# EAGLE design TVHR-PIDer (EAGLE 7.2.0)
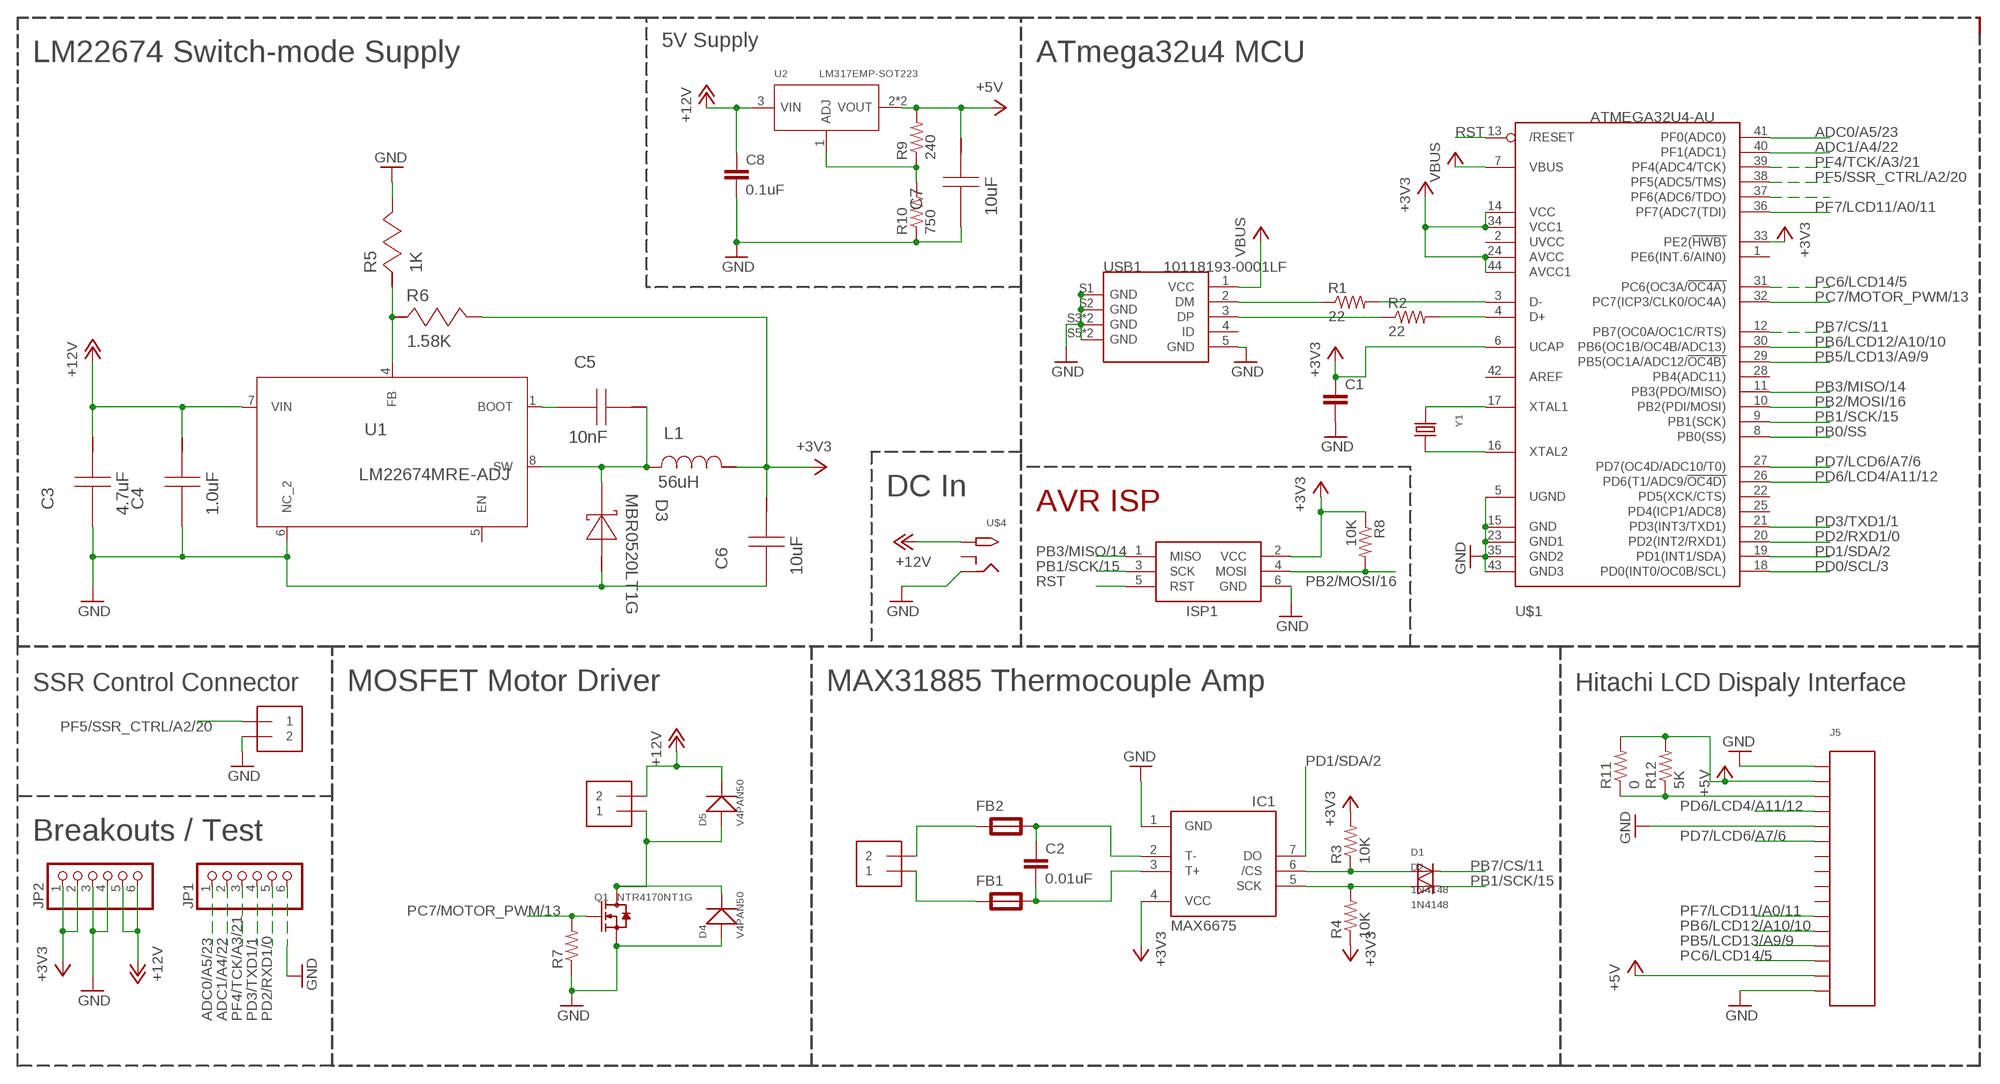
[diagram p0: schematic, sheet 1]

## Parts
C1  C-EUC0603  [C0603]
C2  0.01uF  C-EUC0603  [C0603]
C3  4.7uF  GRM21BR61E475KA12L  [0805]
C4  1.0uF  GRM188R71C105KA12D  [0603]
C5  10nF  C0805C103K5RACTU  [0805]
C6  10uF  GRM219R60J106KE19D  [0805]
C7  10uF  GRM219R60J106KE19D  [0805]
C8  0.1uF  C-EUC0603  [C0603]
D1  1N4148  DIODESOD-323F  [SOD-323F]
D2  1N4148  DIODESOD-323F  [SOD-323F]
D3  MBR0520LT1G  [SOD-123]
D4  V4PAN50  SMD-DIODE-50V-4A(DO-221BC)  [SMD-DIODE-DO221BC-2]
D5  V4PAN50  SMD-DIODE-50V-4A(DO-221BC)  [SMD-DIODE-DO221BC-2]
FB1  FERRITE-BEAD  [R0805]
FB2  FERRITE-BEAD  [R0805]
IC1  MAX6675  [SO08]
ISP1  AVRISP-BOX  [AVRISP-BOX]
J2  1X2-3.5MM  [1X2-3.5MM]
J3  1X2-3.5MM  [1X2-3.5MM]
J4  1X2-3.5MM  [1X2-3.5MM]
J5  16X2-CHAR-LCD-MODULE  [H16-2.54]
JP1  PINHD-1X6  [1X06]
JP2  PINHD-1X6  [1X06]
L1  56uH  ELL-6UH560M  [ELL6UH]
Q1  NTR4170NT1G  SMD-MOSFET-N-CHAN-30V-3.1A-NTR4170N(SOT23)  [SOT-23]
R1  22  R-US_R0603  [R0603]
R2  22  R-US_R0603  [R0603]
R3  10K  R-US_R0603  [R0603]
R4  10K  R-US_R0603  [R0603]
R5  1K  ERJ-6ENF1001V  [0805]
R6  1.58K  ERJ-6ENF1581V  [0805]
R7  R-US_R0603  [R0603]
R8  10K  R-US_R0603  [R0603]
R9  240  R-US_R0603  [R0603]
R10  750  R-US_R0603  [R0603]
R11  0  R-US_R0603  [R0603]
R12  5K  R-US_R0603  [R0603]
U1  LM22674MRE-ADJ  LM22674MRE-ADJ/NOPB  [MRA08B]
U2  LM317EMP-SOT223  PMIC-LDO-LM317EMP(SOT223)  [SOT-223]
U$1  ATMEGA32U4-AU  [TQFP44]
U$4  2.1MMJACKTHM  [PJ-102A]
USB1  10118193-0001LF  MICRO-USB-SMD-B-(10118193-0001LF)  [MICRO-USB5+6P-SMD-0.65-B]
Y1  SMD-XTAL--ABM3B-8.000MHZ-B2-T  [XTAL-SMD-5.0X3.2X1.1MM]

## Nets
+3V3 [PWR]: C1.1 C6.1 IC1.4(VCC) ISP1.2(VCC) JP2.1 JP2.2 L1.2 R3.2 R4.1 R6.1 R8.1 U$1.6(UCAP) U$1.14(VCC) U$1.24(AVCC) U$1.33(PE2(!HWB)) U$1.34(VCC1) U$1.44(AVCC1)
+5V: C7.1 J5.2 J5.15 R9.2 R11.2 R12.2 U2.2(VOUT) U2.TER(VOUT)
+12V: C3.1 C4.1 C8.1 D5.P$2(-) J4.2 JP2.5 JP2.6 U1.7(VIN) U2.3(VIN) U$4.TIP
ADC0/A5/23: JP1.1 U$1.41(PF0(ADC0))
ADC1/A4/22: JP1.2 U$1.40(PF1(ADC1))
GND [PWR]: C1.2 C3.2 C4.2 C6.2 C7.2 C8.2 D3.2(A) D4.P$1(+) IC1.1(GND) ISP1.6(GND) J3.2 J5.1 J5.5 J5.16 JP1.6 JP2.3 JP2.4 Q1.2(S) R5.1 R7.1 R10.1 U1.6(NC_2) U$1.5(UGND) U$1.15(GND) U$1.23(GND1) U$1.35(GND2) U$1.43(GND3) U$4.RING USB1.5(GND) USB1.S1(GND) USB1.S2(GND) USB1.S3(GND) USB1.S4(GND) USB1.S5(GND) USB1.S6(GND)
N$1: R1.2 U$1.3(D-)
N$2: R1.1 USB1.2(DM)
N$3: R2.1 USB1.3(DP)
N$4: U$1.17(XTAL1) Y1.P$1
N$5: R2.2 U$1.4(D+)
N$6: U$1.16(XTAL2) Y1.P$2
N$7: C2.1 FB2.2 IC1.2(T-)
N$8: C2.2 FB1.2 IC1.3(T+)
N$9: R9.1 R10.2 U2.1(ADJ)
N$10: FB2.1 J2.2
N$11: FB1.1 J2.1
N$12: R5.2 R6.2 U1.4(FB)
N$13: J5.3 R11.1 R12.1
N$17: C5.2 U1.1(BOOT)
N$18: C5.1 D3.1(K) L1.1 U1.8(SW)
N$19: D4.P$2(-) D5.P$1(+) J4.1 Q1.3(D)
N$22: U$1.37(PF6(ADC6/TDO))
PB0/SS: U$1.8(PB0(SS))
PB1/SCK/15: D2.A D2.C IC1.5(SCK) ISP1.3(SCK) R4.2 U$1.9(PB1(SCK))
PB2/MOSI/16: ISP1.4(MOSI) R8.2 U$1.10(PB2(PDI/MOSI))
PB3/MISO/14: ISP1.1(MISO) U$1.11(PB3(PDO/MISO))
PB5/LCD13/A9/9: J5.13 U$1.29(PB5(OC1A/ADC12/!OC4B))
PB6/LCD12/A10/10: J5.12 U$1.30(PB6(OC1B/OC4B/ADC13))
PB7/CS/11: D1.A D1.C IC1.6(/CS) R3.1 U$1.12(PB7(OC0A/OC1C/RTS))
PC6/LCD14/5: J5.14 U$1.31(PC6(OC3A/!OC4A))
PC7/MOTOR_PWM/13: Q1.1(G) R7.2 U$1.32(PC7(ICP3/CLK0/OC4A))
PD0/SCL/3: U$1.18(PD0(INT0/OC0B/SCL))
PD1/SDA/2: IC1.7(DO) U$1.19(PD1(INT1/SDA))
PD2/RXD1/0: JP1.5 U$1.20(PD2(INT2/RXD1))
PD3/TXD1/1: JP1.4 U$1.21(PD3(INT3/TXD1))
PD6/LCD4/A11/12: J5.4 U$1.26(PD6(T1/ADC9/!OC4D))
PD7/LCD6/A7/6: J5.6 U$1.27(PD7(OC4D/ADC10/T0))
PF4/TCK/A3/21: JP1.3 U$1.39(PF4(ADC4/TCK))
PF5/SSR_CTRL/A2/20: J3.1 U$1.38(PF5(ADC5/TMS))
PF7/LCD11/A0/11: J5.11 U$1.36(PF7(ADC7(TDI))
RST: ISP1.5(RST) U$1.13(/RESET)
VBUS [PWR]: U$1.7(VBUS) USB1.1(VCC)
Unconnected: J5.7 J5.8 J5.9 J5.10 U1.5(EN) U$1.1(PE6(INT.6/AIN0)) U$1.2(UVCC) U$1.22(PD5(XCK/CTS)) U$1.25(PD4(ICP1/ADC8)) U$1.28(PB4(ADC11)) U$1.42(AREF) U$4.RING_SW USB1.4(ID)

## Notes on the sheet
- 5V Supply
- LM22674 Switch-mode Supply | ATmega32u4 MCU
- DC In
- AVR ISP
- SSR Control Connector | MOSFET Motor Driver | MAX31885 Thermocouple Amp | Hitachi LCD Dispaly Interface
- Breakouts / Test

## Library data of the parts
C1 C2 C8 = resistor:C-EU: CAPACITOR, European symbol
C3 = TI_LM22674:GRM21BR61E475KA12L; CAP: 4.7E-6; ESR: 0.0040; IRMS: 0.0; MANUFACTURER_NAME: MuRata; MANUFACTURER_PART_NUMBER: GRM21BR61E475KA12L; VDC: 25.0; VENDOR: MuRata
C4 = TI_LM22674:GRM188R71C105KA12D; CAP: 1.0E-6; ESR: 0.011; IRMS: 0.0; MANUFACTURER_NAME: MuRata; MANUFACTURER_PART_NUMBER: GRM188R71C105KA12D; VDC: 16.0; VENDOR: MuRata
C5 = TI_LM22674:C0805C103K5RACTU; CAP: 1.0E-8; ESR: 1.739; IRMS: 0.411; MANUFACTURER_NAME: Kemet; MANUFACTURER_PART_NUMBER: C0805C103K5RACTU; VDC: 50.0; VENDOR: Kemet
C6 C7 = TI_LM22674:GRM219R60J106KE19D; CAP: 1.0E-5; ESR: 0.0030; IRMS: 0.0; MANUFACTURER_NAME: MuRata; MANUFACTURER_PART_NUMBER: GRM219R60J106KE19D; VDC: 6.3; VENDOR: MuRata
D1 D2 = adafruit:DIODE: Diode SMADIODE - SMA Surface Mount Package 20V 1A Schottky Diode Digikey: 641-1014-6-ND DO-1N4148 - Through Hole Small Current Diode SOD-123 20V 1 A (.5mV Vf) Schottky Diode - Digikey: MBRX120TPMSCT-ND SOD-323 10V 570mA (.38mV Vf, 3ns) Schottky Diode - Digikey: ZLLS410CT-ND SOD-523 30V 30mA Schottky Diode (RB751S-40TE61) - Digikey: RB751S-40TE61CT-ND SOT23-R/W - SOT23 Package (R = Solder Paste/Reflow Ovens, W = Hand-Soldering) BAT54Film 40V 300mA - Digikey: 497-7162-1-ND
D3 = TI_LM22674:MBR0520LT1G; DATASHEETURL: http://www.onsemi.com/pub%5Flink/Collateral/MBR0520LT1%2DD.PDF; IO: 0.5; MANUFACTURER_NAME: ON Semiconductor; MANUFACTURER_PART_NUMBER: MBR0520LT1G; VENDOR: ON Semiconductor; VFATIO: 0.385; VRRM: 20.0
D4 D5 = TVHeadedRobots-library:SMD-DIODE-50V-4A(DO-221BC); MF: VISHAY; MPN: V4PAN50; OC_MOUSER: 78-V4PAN50-M3/I
FB1 FB2 = TVHeadedRobots-library:FERRITE-BEAD
IC1 = adafruit:MAX6675
ISP1 = adafruit:AVRISP: AVR ISP HEADER Standard 6 pin header for AVR programming
J2-J4 = adafruit:1X2: 3.5mm Terminal block http://www.ladyada.net/library/pcb/eaglelibrary.html
J5 = TVHeadedRobots-library:16X2-CHAR-LCD-MODULE
JP1 JP2 = adafruit:PINHD-1X6: PIN HEADER
L1 = TI_LM22674:ELL-6UH560M; DCR: 0.21; IDC: 0.8; L: 5.6E-5; MANUFACTURER_NAME: Panasonic; MANUFACTURER_PART_NUMBER: ELL-6UH560M; VENDOR: Panasonic
Q1 = TVHeadedRobots-library:SMD-MOSFET-N-CHAN-30V-3.1A-NTR4170N(SOT23): NTR4170NT1G N-Chan Power MOSFET 30V / 3.1A; MPN: NTR4170N; OC_MOUSER: 863-NTR4170NT1G
R1-R4 R7-R12 = resistor:R-US_: RESISTOR, American symbol
R5 = TI_LM22674:ERJ-6ENF1001V; MANUFACTURER_NAME: Panasonic; MANUFACTURER_PART_NUMBER: ERJ-6ENF1001V; POWER: 0.125; RESISTANCE: 1000.0; TOLERANCE: 1.0; VENDOR: Panasonic
R6 = TI_LM22674:ERJ-6ENF1581V; MANUFACTURER_NAME: Panasonic; MANUFACTURER_PART_NUMBER: ERJ-6ENF1581V; POWER: 0.125; RESISTANCE: 1580.0; TOLERANCE: 1.0; VENDOR: Panasonic
U1 = TI_LM22674:LM22674MRE-ADJ/NOPB; DATASHEETURL: http://www.ti.com/product/lm22674; FREQUENCY: 500000.0; IMAX: 0.5; MANUFACTURER_NAME: Texas Instruments; MANUFACTURER_PART_NUMBER: LM22674MRE-ADJ/NOPB; MKTG_PACKAGE: NA; NSID: LM22674MRE-5.0/NOPB; PACKAGE: NA; VENDOR: Texas Instruments
U2 = Seeed-OPL-ic:PMIC-LDO-LM317EMP(SOT223): 310030006; MPN: LM317EMP
U$1 = adafruit:ATMEGA32U4: http://www.ladyada.net/library/eagle
U$4 = adafruit:2.1MMJACK: 2.1mm x 5.5mm THM DC jack with internal switch. Digikey part #PJ-102A, 4UCON part #05537 2.1mm x 5.5mm SMT DC jack with internal switch. Digikey part #PJ-002A-SMT, 4UCON part #03267 By microbuilder.eu & adafruit.com
USB1 = Seeed-OPL-Connector:MICRO-USB-SMD-B-(10118193-0001LF): 320010003; MPN: 10118193-0001LF
Y1 = TVHeadedRobots-library:SMD-XTAL--ABM3B-8.000MHZ-B2-T; MF: Abracon; MPN: ABM3B-8.000MHZ-B2-T; OC_MOUSER: 815-ABM3B-8.0-B2-T

## Net classes
0 default: width 0.203 mm, clearance 0.203 mm
1 PWR: width 0.406 mm, clearance 0.406 mm
2 ADC: width 0.203 mm, clearance 0.406 mm
3 PWM: width 0.203 mm, clearance 0.305 mm

## Board
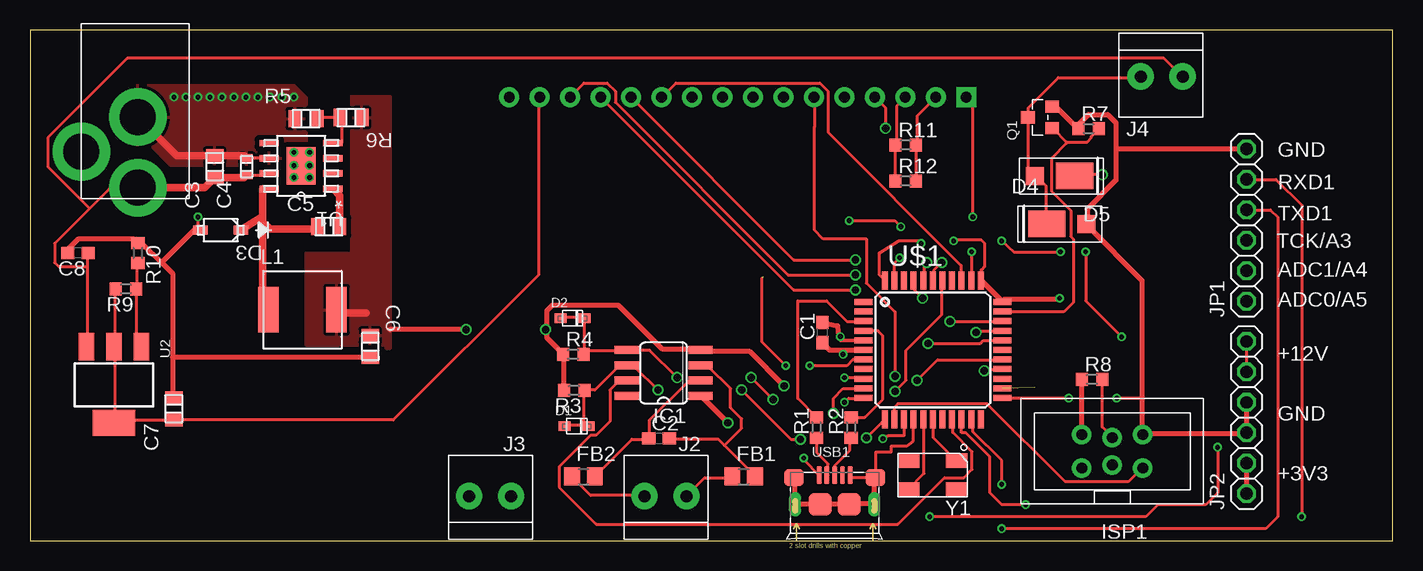
[diagram p1: board, top side]
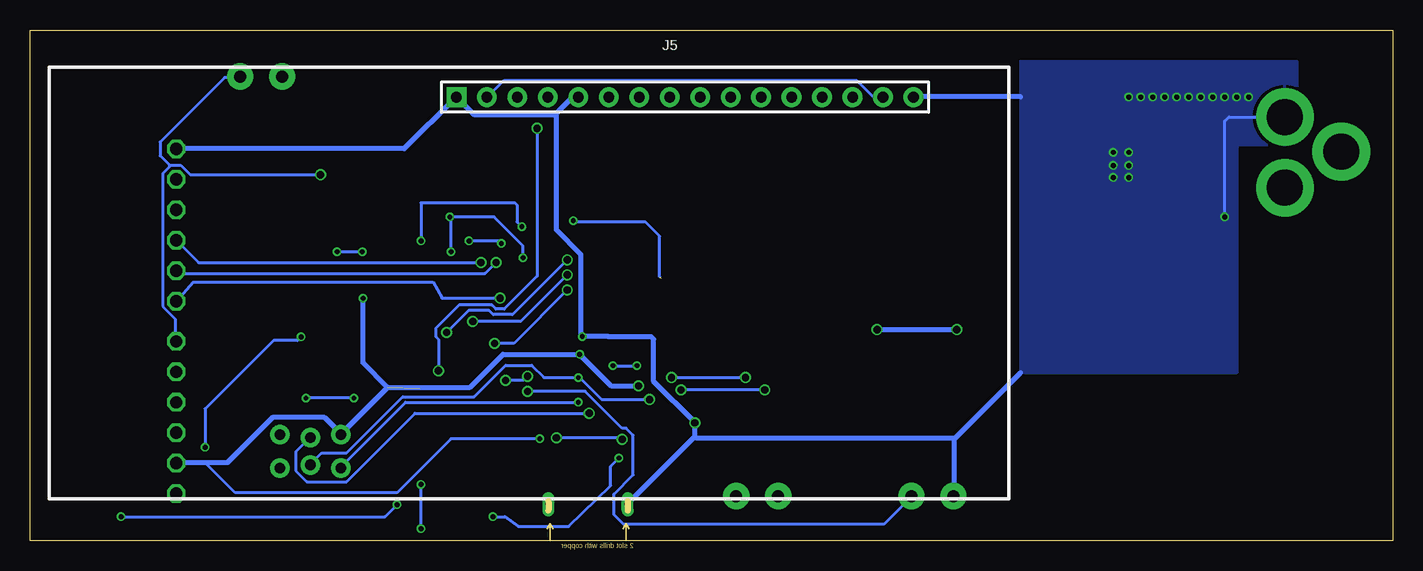
[diagram p2: board, bottom side, seen from below]

Size 113.6 x 42.6 mm. Coordinates in mm from the lower left corner, seen from the top.
Outline: 0,0 113.6,0 113.6,42.6 0,42.6 0,0
Copper layers (1*16): Top 0.035mm / dielectric 1.5mm / Bottom 0.035mm
Design rules "SeeedStudio_2layer_DRU_no_angle_20140221": minimum track width 6mil, minimum drill 12mil, track to track 6mil, track to pad 6mil, pad to pad 6mil, via to via 6mil, smd to smd 0mil, copper to edge 10mil, drill to drill 10mil, minimum pad ring 10mil, minimum via ring 6mil, stop-mask expansion 2mil, vias tented up to drill 100mil, thermal gap 10mil

### Footprints (pad centres in the part's own frame; a part is rotated, then mirrored left to right if it is on the bottom)
C0603 = smd 1.1 x 1: 1 -0.85,0; 2 0.85,0
0805 = smd 1.118 x 1.448: 1 -0.902,0; 2 0.902,0
0603 = smd 0.66 x 0.965: 1 -0.699,0; 2 0.699,0
SOD-323F = smd 1 x 0.8: A -1,0; C 1,0
SOD-123 = smd 1.219 x 0.762: 1 -1.676,0; 2 1.676,0
SMD-DIODE-DO221BC-2 = smd 1.5 x 1.52: P$1 1.19,0 | smd 3.1 x 2.2: P$2 -2.11,0
R0805 = smd 1.3 x 1.5: 1 -0.95,0; 2 0.95,0
SO08 = smd 0.66 x 2.032: 1 -1.905,-3.073; 2 -0.635,-3.073; 3 0.635,-3.073; 4 1.905,-3.073; 5 1.905,3.073; 6 0.635,3.073; 7 -0.635,3.073; 8 -1.905,3.073
AVRISP-BOX = drill 0.9 pad 1.626: 1 -1.397,2.54; 2 1.397,2.54; 3 -1.143,0; 4 1.143,0; 5 -1.397,-2.54; 6 1.397,-2.54
1X2-3.5MM = drill 1 pad 2.184: 1 1.8,0; 2 -1.7,0
H16-2.54 = drill 0.889 pad 1.651 square: 1 -19.05,0 | drill 0.889 pad 1.651: 2 -16.51,0; 3 -13.97,0; 4 -11.43,0; 5 -8.89,0; 6 -6.35,0; 7 -3.81,0; 8 -1.27,0; 9 1.27,0; 10 3.81,0; 11 6.35,0; 12 8.89,0; 13 11.43,0; 14 13.97,0; 15 16.51,0; 16 19.05,0
1X06 = drill 1.016 octagon: 1 -6.35,0; 2 -3.81,0; 3 -1.27,0; 4 1.27,0; 5 3.81,0; 6 6.35,0
ELL6UH = smd 1.702 x 3.81: 1 -2.845,0; 2 2.845,0
SOT-23 = smd 1.016 x 1.143: 1 -0.889,-1.016; 2 0.889,-1.016; 3 0,1.016
R0603 = smd 1 x 1.1: 1 -0.85,0; 2 0.85,0
MRA08B = smd 1.6 x 0.533: 1 -2.654,1.905; 2 -2.654,0.635; 3 -2.654,-0.635; 4 -2.654,-1.905; 5 2.654,-1.905; 6 2.654,-0.635; 7 2.654,0.635; 8 2.654,1.905 | smd 2.413 x 3.099: 9 0,0
SOT-223 = smd 1.27 x 2.286: 1 -2.286,-3.175; 2 0,-3.175; 3 2.286,-3.175 | smd 3.556 x 2.159: TER 0,3.175
TQFP44 = smd 1.5 x 0.5: 1 -5.8,4; 2 -5.8,3.2; 3 -5.8,2.4; 4 -5.8,1.6; 5 -5.8,0.8; 6 -5.8,0; 7 -5.8,-0.8; 8 -5.8,-1.6; 9 -5.8,-2.4; 10 -5.8,-3.2; 11 -5.8,-4; 23 5.8,-4; 24 5.8,-3.2; 25 5.8,-2.4; 26 5.8,-1.6; 27 5.8,-0.8; 28 5.8,0; 29 5.8,0.8; 30 5.8,1.6; 31 5.8,2.4; 32 5.8,3.2; 33 5.8,4 | smd 0.5 x 1.5: 12 -4,-5.8; 13 -3.2,-5.8; 14 -2.4,-5.8; 15 -1.6,-5.8; 16 -0.8,-5.8; 17 0,-5.8; 18 0.8,-5.8; 19 1.6,-5.8; 20 2.4,-5.8; 21 3.2,-5.8; 22 4,-5.8; 34 4,5.8; 35 3.2,5.8; 36 2.4,5.8; 37 1.6,5.8; 38 0.8,5.8; 39 0,5.8; 40 -0.8,5.8; 41 -1.6,5.8; 42 -2.4,5.8; 43 -3.2,5.8; 44 -4,5.8
PJ-102A = drill 3 pad 4.8: RING 0.1,-3.39; RING_SW -4.6,-6.29; TIP 0.1,-9.29
MICRO-USB5+6P-SMD-0.65-B = smd 0.4 x 1.5: 1 -1.3,-0.25; 2 -0.65,-0.25; 3 0,-0.25; 4 0.65,-0.25; 5 1.3,-0.25 | smd 1.6 x 1.4: S1 -3.4,-0.427; S6 3.4,-0.427 | drill 0.508 pad 1.016 long: S2 -3.3,-2.675; S5 3.3,-2.675 | smd 1.9 x 1.9: S3 -1.2,-2.675; S4 1.2,-2.675
XTAL-SMD-5.0X3.2X1.1MM = smd 1.8 x 1.2: P$1 -2,-1.2; P$2 2,1.2; P$3 2,-1.2; P$4 -2,1.2

### Placement (x,y rotation side)
C1  66.06,17.36 90 top
C2  52.44,8.55 0 top
C3  15.41,31.2 90 top
C4  18.06,31.2 90 top
C5  24.91,26.2 0 top
C6  28.36,16.2 270 top
C7  12,11 90 top
C8  4,24 180 top
D1  45.58,9.55 0 top
D2  45.23,18.55 0 top
D3  15.9,25.91 180 top
D4  86.87,26.42 0 top
D5  84.98,30.42 180 top
FB1  59.49,5.36 0 top
FB2  46.14,5.36 0 top
IC1  52.82,13.99 90 top
ISP1  90.22,7.46 90 top
J2  52.93,3.72 0 top
J3  38.31,3.72 0 top
J4  94.39,38.72 180 top
J5  59,37 0 bottom
JP1  101.41,26.33 90 top
JP2  101.41,10.28 90 top
L1  22.71,19.26 0 top
Q1  84.2,35.31 90 top
R1  65.57,9.45 90 top
R2  68.46,9.45 90 top
R3  45.36,12.55 180 top
R4  45.28,15.55 0 top
R5  23.01,35.2 0 top
R6  26.76,35.3 180 top
R7  88.25,34.36 0 top
R8  88.53,13.46 0 top
R9  8,21 180 top
R10  9,24 270 top
R11  73,33 0 top
R12  73,30 0 top
U1  22.6,31.26 180 top
U2  7,13 180 top
U$1  75.26,15.91 0 top
U$4  8.89,38.74 0 top
USB1  67.08,5.71 0 top
Y1  75.26,5.48 180 top

### Tracks (layer width: path | path; a pad name or v marks a point on that pad's centre or on a via)
+3V3  (via drill 0.4, 0.61)  (1 unrouted)
  Top 0.254: U$1.44 70.8,22.17 70.8,24 72.4,25 74.1,25 v74.3,24.8 | 77.2,25 v77,25 77,25.1 79.3,25.1 79.6,24.8 79.6,22.9 79.3,22.6 79.3,21.75 U$1.34 | U$1.14 72.86,8.76 71.56,8.76 v71.1,8.5
  Top 0.406: C1.1 66.66,15.91 67.78,15.91 | 67.78,15.91 U$1.6 | R3.2 44.46,12.57 44.46,15.54 R4.1 44.35,15.66 43.09,16.92 43.09,17.6 | 43.09,17.6 43.09,19.2 43.55,19.66 49.03,19.66 52.69,16 55.89,16 IC1.4 56.01,15.77 60.01,15.77 v62.87,12.92 | JP2.1 101.38,4 101.38,6.4 JP2.2 | U$1.34 79.32,21.72 81.04,20 U$1.33 81.15,20.12 85.72,20.12 v85.84,20.23 | R8.1 87.67,13.37 87.67,8.91 ISP1.2 | v67.78,15.54 67.78,15.91 | v36.35,17.6 30,17.6 | v42.98,17.6 43.09,17.6
  Top 0.61: L1.2 25.82,19 28,19
  Bottom 0.254: v71.1,8.5 78.5,8.5 83,4 96.48,4 99,6.51 | v74.3,24.8 74.5,25 v77,25
  Bottom 0.406: 83.78,12.8 76.92,12.8 74.18,15.54 v67.78,15.54 65.15,12.92 v62.87,12.92 | 83.78,12.8 87.67,8.91 ISP1.2 87.78,9.03 89.04,10.29 93.38,10.29 97.16,6.51 99,6.51 101.38,6.51 JP2.2 | v85.84,20.23 85.84,14.86 83.78,12.8 | v42.98,17.6 v36.35,17.6
  pour Top: 29.7,16.3 23,16.3 23,24 26.8,24 26.8,37.1 30,37.1 30,16 29.7,16
+5V
  Top 0.254: R9.2 7.09,20.92 7.09,16.23 U2.2 7.09,16.12 7.09,10.4 7.32,10.17 U2.TER 7.09,9.83 7.32,10.06 11.89,10.06 C7.1 12.12,10.06 30.29,10.06 42.41,22.17 42.41,36.92 J5.15 | R12.2 73.84,30.06 73.84,32.92 R11.2 73.95,33.03 73.95,35.43 75.44,36.92 J5.2
  Bottom 0.254: J5.15 42.52,37.03 43.32,37.03 44.69,38.41 74.07,38.41 75.44,37.03 J5.2
+12V  (via drill 0.61)
  Top 0.254: 17.86,30.3 C4.1 19.82,30.5 U1.7 | 4.8,22.86 4.8,16.23 U2.3 | 4.8,22.86 4.8,23.89 C8.1 | 4.8,22.86 2.4,22.86 2.06,23.2 2.06,24.8 4.97,27.72 | 4.97,27.72 6.63,29.38 8.69,29.38 U$4.TIP | JP2.5 101.38,14.17 101.38,16.57 JP2.6 | v89.38,30.52 87.1,30.52 D5.P$2 | 4.97,27.72 1.49,31.2 1.49,33.6 8.12,40.23 94.53,40.23 96.01,38.75 J4.2
  Top 0.61: U$4.TIP 14.56,29.45 C3.1 17.86,30.3
  Bottom 0.254: v89.38,30.52 100.24,30.52 101.04,31.32 101.96,31.32 | 101.96,31.32 102.76,32.12 102.76,33.26 97.38,38.63 96.13,38.63 J4.2 | JP2.6 101.5,16.69 101.5,18.52 102.53,19.55 102.53,30.63 101.96,31.2 101.96,31.32
ADC0/A5/23  (via drill 0.61)
  Top 0.254: v74.41,20.23 73.72,20.92 73.72,21.6 U$1.41
  Bottom 0.254: v74.41,20.23 79.25,20.23 80,21.57 100.01,21.57 101.38,20 JP1.1
ADC1/A4/22  (via drill 0.61)
  Top 0.254: v74.75,23.2 74.52,22.97 74.52,21.72 U$1.40
  Bottom 0.254: v74.75,23.2 75.67,22.29 101.16,22.29 101.38,22.52 JP1.2
GND  (via drill 0.4, 0.61)
  Top 0.254: 17.86,32.1 C4.2 U1.6 | D3.2 14,26.13 v14,27 | USB1.5 68.56,5.28 USB1.S6 70.48,7.38 70.5,7.4 71.8,7.4 71.8,7.9 73.1,7.9 73.6,8.3 73.6,10.05 U$1.15 | U$1.23 v86.6,11.9 | v90.6,11.9 92.7,11.9 | U$1.35 78.5,21.71 v78.5,24.1 | v78.6,27 78.6,36.45 J5.1 | U$1.43 72.06,23.16 v72.5,23.6
  Top 0.305: 67.34,17.93 67.56,16.71 U$1.5
  Top 0.406: C1.2 67.34,17.93 67.44,17.03 v67.55,17.03 | C8.2 3.2,24 3.2,24.35 4,25.15 8.69,25.15 8.91,24.92 R10.1 9.14,24.8 9.37,24.8 10.97,23.2 | 11.89,15.32 11.89,22.29 10.97,23.2 | 11.89,15.32 11.89,12 C7.2 | 11.89,15.32 28.35,15.32 C6.2 | 10.97,23.2 13.95,26.18 D3.2 | JP2.4 101.38,11.54 101.38,9.03 JP2.3 101.27,8.91 92.81,8.91 ISP1.6 92.7,9.03 92.7,11.9 92.7,21.72 88.12,26.29 D4.P$1 88.12,26.52 88.12,27.66 90.53,30.06 90.53,32.69 | Q1.2 85.27,36.12 85.61,36.12 87.33,34.4 R7.1 87.33,34.63 88.24,35.55 89.84,35.55 90.53,34.86 90.53,32.69 | 90.53,32.69 101.38,32.69 JP1.6 | USB1.S6 70.41,5.26 70.41,3.09 USB1.S5 70.18,3.09 68.35,3.09 USB1.S4 68.12,3.09 66.06,3.09 USB1.S3 65.84,3.09 63.89,3.09 USB1.S2 63.78,3.09 63.78,5.26 USB1.S1 | v58.18,9.83 56.01,12 IC1.1
  Top 0.61: 17.86,32.1 C3.2 12.24,32.1 U$4.RING
  Bottom 0.254: v14,27 14,35 13.65,35.35 U$4.RING | v86.6,11.9 v90.6,11.9 | v78.5,24.1 78.5,26.9 v78.6,27 74.9,27 72.5,24.6 v72.5,23.6
  Bottom 0.406: 31,37.03 39.89,37.03 J5.16 | 36.58,8.46 36.58,3.77 J3.2 | 36.58,8.46 31.09,13.95 31,14 | 69.84,35.55 68.47,36.92 67.89,36.92 J5.5 | 69.84,35.55 76.58,35.55 77.95,36.92 J5.1 78.18,36.92 82.41,32.69 101.38,32.69 JP1.6 | 58.18,8.69 v58.18,9.83 58.18,9.88 61.6,13.3 61.6,16.8 61.8,17 65.35,17 65.38,17.03 v67.55,17.03 67.67,17.14 67.67,23.89 69.72,25.95 69.72,35.43 69.84,35.55 | 58.18,8.69 63.78,3.09 USB1.S2 | 36.58,8.46 36.69,8.57 58.06,8.57 58.18,8.69
  other vias: 12,37 13,37 14,37 15,37 16,37 17,37 18,37 19,37 20,37 21,37 22,37 22,32.4 23.3,32.4 22,31.3 23.3,31.3 23.3,30.3 22,30.3
  pour Top: 23,37 23,31.3 11.7,31.3 10,33 7,33 7,38 22,38
  pour Bottom: 31,40 8,40 8,33 13,33 13,14 31,14
N$1
  Top 0.254: R1.2 64,11.87 64,20 66.4,20 68.1,18.3 U$1.3
  Top 0.406: U$1.3
N$2
  Top 0.254: R1.1 65.61,8.57 65.61,7.32 66.52,6.4 66.52,5.49 USB1.2
N$3
  Top 0.254: R2.1 68.35,8.57 68.35,7.54 67.09,6.29 67.09,5.49 USB1.3
N$4
  Top 0.254: U$1.17 75.32,10.06 75.32,8.57 77.15,6.74 Y1.P$1
N$5
  Top 0.254: R2.2 69.6,10.3 71.1,11.8 71.1,17.1 70.7,17.5 70.69,17.51 U$1.4
N$6
  Top 0.254: U$1.16 74.52,10.06 74.52,5.6 73.27,4.34 Y1.P$2
N$7
  Top 0.254: FB2.2 47.09,5.37 50.18,8.46 51.55,8.46 C2.1 51.66,8.57 51.66,10.06 54.86,13.26 55.89,13.26 IC1.2
N$8
  Top 0.254: 57.89,7.94 60.47,5.37 FB1.2 | 57.89,7.94 57.38,8.46 53.38,8.46 C2.2 | 57.89,7.94 59.32,9.37 59.32,10.17 58.41,11.09 58.41,12.69 56.58,14.52 56.01,14.52 IC1.3
N$9
  Top 0.254: R10.2 8.91,23.09 8.91,21.03 R9.1 8.91,20.92 8.91,16.57 9.26,16.23 U2.1
N$10
  Top 0.254: FB2.1 45.26,5.26 46.75,3.77 51.21,3.77 J2.2
N$11
  Top 0.254: FB1.1 58.52,5.26 56.24,5.26 54.75,3.77 J2.1
N$12
  Top 0.254: U1.4 26,33.16 26,35 25.76,35 R6.2 23.91,35.3 R5.2
N$13
  Top 0.254: R12.1 72.12,30.06 72.12,32.92 R11.1 72.24,33.03 72.24,36.23 72.92,36.92 J5.3
N$17
  Top 0.61: U1.1 25.81,28.8 C5.2
N$18
  Top 0.61: C5.1 23.81,26 20,26 19.4,26.6 | 19.4,26.6 19.4,27 | 19.4,27 19.4,29.3 19.45,29.36 U1.8 | L1.1 19.4,19.73 19.4,26.6 | D3.1 19.31,27 19.4,27
N$19
  Top 0.254: D4.P$2 84.7,26.52 84.7,29.6 83.9,30.4 D5.P$1 83.78,30.52 83.21,31.09 83.21,35.2 Q1.3 83.21,35.43 83.21,36.12 85.72,38.63 92.58,38.63 J4.1
PB1/SCK/15  (via drill 0.4, 0.61)
  Top 0.254: D2.A 44.23,18.63 46.18,18.63 D2.C 46.18,18.52 46.18,15.66 R4.2 46.29,15.89 49.72,15.89 IC1.5 49.84,15.89 51.66,15.89 v53.95,13.6 | v67.89,13.6 69.38,13.6 U$1.9 | v61.95,11.77 v60.12,13.6
  Bottom 0.254: ISP1.3 90.18,6.4 89.27,7.32 87.21,7.32 82.53,12 76.58,12 73.95,14.63 71.78,14.63 70.75,13.6 v67.89,13.6 67.78,13.6 65.95,11.77 v61.95,11.77 | v60.12,13.6 v53.95,13.6
PB2/MOSI/16  (via drill 0.61)
  Top 0.254: R8.2 89.38,13.37 89.38,9.49 90.18,8.69 ISP1.4 | v66.98,10.63 66.98,11.89 67.78,12.69 69.38,12.69 U$1.10
  Bottom 0.254: v66.98,10.63 81.5,10.63 87.21,4.92 90.53,4.92 91.44,5.83 91.44,7.43 90.3,8.57 ISP1.4
PB3/MISO/14  (via drill 0.4)
  Top 0.254: v67.89,11.54 68.24,11.89 69.38,11.89 U$1.11
  Bottom 0.254: v67.89,11.54 82.3,11.54 87.67,6.17 ISP1.1
PB5/LCD13/A9/9  (via drill 0.61)
  Top 0.254: v74.87,16.46 79.21,16.46 79.44,16.69 81.04,16.69 U$1.29 | v68.81,20.92 63.66,20.92 47.66,36.92 J5.13
  Bottom 0.254: v74.87,16.46 73.27,16.46 v68.81,20.92
PB6/LCD12/A10/10  (via drill 0.61)
  Top 0.254: v78.87,17.37 78.98,17.49 81.04,17.49 U$1.30 | v68.81,23.43 63.66,23.43 50.18,36.92 J5.12
  Bottom 0.254: v78.87,17.37 77.04,19.2 75.32,19.2 74.98,18.86 73.38,18.86 v68.81,23.43
PB7/CS/11  (via drill 0.61)
  Top 0.254: D1.A 44.69,9.6 46.52,9.6 D1.C 46.18,9.72 46.18,12.46 R3.1 46.29,12.57 47.09,12.57 49.03,14.52 49.72,14.52 IC1.6 49.84,14.52 50.41,14.52 v52.35,12.57 | v69.72,8.57 71.21,10.06 U$1.12 | v64.24,8.46 63.44,8.46 v59.32,12.57
  Bottom 0.254: v69.72,8.57 64.35,8.57 v64.24,8.46 | v52.35,12.57 v59.32,12.57
PC6/LCD14/5  (via drill 0.61)
  Top 0.254: v76.69,18.29 81.04,18.29 U$1.31 | v68.81,22.17 63.21,22.17 48.81,36.58 48.81,37.49 48.12,38.18 46.18,38.18 45.03,37.03 J5.14
  Bottom 0.254: v76.69,18.29 72.69,18.29 v68.81,22.17
PC7/MOTOR_PWM/13
  Top 0.254: 86.41,33.26 88.12,33.26 88.47,33.6 88.47,33.72 89.04,34.29 R7.2 | 86.41,33.26 85.27,34.4 Q1.1 | U$1.32 81.15,19.09 86.18,19.09 86.98,19.89 86.98,25.15 86.75,25.38 86.75,27.55 85.15,29.15 85.15,31.89 86.41,33.15 86.41,33.26
PD1/SDA/2
  Top 0.254: U$1.19 76.92,10.06 76.92,9.03 78.52,7.43 78.52,5.94 77.84,5.26 76.24,5.26 72.35,1.37 47.21,1.37 44.12,4.46 44.12,6.17 46.75,8.8 47.21,8.8 48.35,9.94 48.35,12.57 49.03,13.26 49.72,13.26 IC1.7
PD2/RXD1/0  (via drill 0.4)
  Top 0.254: JP1.5 103.86,30.14 106,28 v106,2 | v83,3 81,3 80,4 80,7 78,9 77.66,9 U$1.20
  Bottom 0.254: v106,2 84,2 v83,3
PD3/TXD1/1  (via drill 0.4)
  Top 0.254: JP1.4 103.4,27.6 104,27 104,2 103,1 v81,1 | v81,4.7 81,6.7 78.6,9.1 78.6,9.97 U$1.21
  Bottom 0.254: v81,1 v81,4.7
PD6/LCD4/A11/12  (via drill 0.61)
  Top 0.254: v79.55,14.17 79.67,14.29 81.04,14.29 U$1.26 | v71.32,34.4 71.32,36.12 70.52,36.92 J5.4
  Bottom 0.254: v79.55,14.17 79.55,16.8 79.78,17.03 79.78,17.72 77.84,19.66 75.09,19.66 74.75,19.32 74.07,19.32 71.32,22.06 v71.32,34.4
PD7/LCD6/A7/6  (via drill 0.61)
  Top 0.254: v73.95,13.37 75.67,15.09 81.04,15.09 U$1.27 | v72.12,13.72 72.12,19.09 69.72,21.49 69.72,25.18 66.12,25.18 65.4,25.9 65.4,34.5 65.38,34.52 65.38,36.92 J5.6
  Bottom 0.254: v73.95,13.37 72.47,13.37 v72.12,13.72
PF4/TCK/A3/21  (via drill 0.61)
  Top 0.254: v76.01,23.2 75.32,22.52 75.32,21.72 U$1.39
  Bottom 0.254: v76.01,23.2 99.56,23.2 101.38,25.03 JP1.3
PF5/SSR_CTRL/A2/20  (via drill 0.61)
  Top 0.254: v72.12,12.46 73.04,13.37 73.04,15.89 76.01,18.86 76.01,21.6 U$1.38
  Bottom 0.254: v72.12,12.46 67.32,12.46 64.24,9.37 63.89,9.37 63.32,8.8 63.32,5.49 64.92,3.89 64.92,2.17 64.12,1.37 42.41,1.37 40.12,3.66 J3.1
PF7/LCD11/A0/11
  Top 0.254: U$1.36 77.61,21.72 77.61,22.97 66.52,34.06 66.52,37.49 65.84,38.18 53.84,38.18 52.69,37.03 J5.11
RST
  Top 0.254: U$1.13 72.01,10.17 72.01,11.09 72.35,11.43 79.78,11.43 86.3,4.92 91.55,4.92 92.7,6.06 ISP1.5
VBUS  (via drill 0.4)  (1 unrouted)
  Top 0.254: U$1.7 68.61,15.11 68.1,14.6 v65,14.6 | v63,14.6 61,16.6 61,21.9 | v68.3,26.7 72.1,26.7 v72.6,26.2 | v81,25 82,24.1 v85.9,24.1 | v75,2 93,2 94,3 98,3 99,4 v99,7.8 | v64.5,6.9 64.5,6.74 USB1.1 | v88,24.1 88,20 v91,17
  Bottom 0.254: v65,14.6 v63,14.6 | 61.1,22 61.1,25.4 62.3,26.6 68.2,26.6 v68.3,26.7 | v81,25 81,28.2 73.2,28.2 73,28 73,26.6 v72.6,26.2 | v85.9,24.1 v88,24.1 | v75,2 74,2 72.9,1.2 68.7,1.2 65.2,4.6 65.2,6.2 v64.5,6.9 | v91,17 91.3,16.7 93.3,16.7 99,11 v99,7.8

### Text on the board
tSilk: GND | RXD1 | TXD1 | TCK/A3 | ADC1/A4 | ADC0/A5 | +12V | GND | +3V3